# Altium schematic sheet LEDS & BUTTONS.SchDoc
size 381 x 241 mm
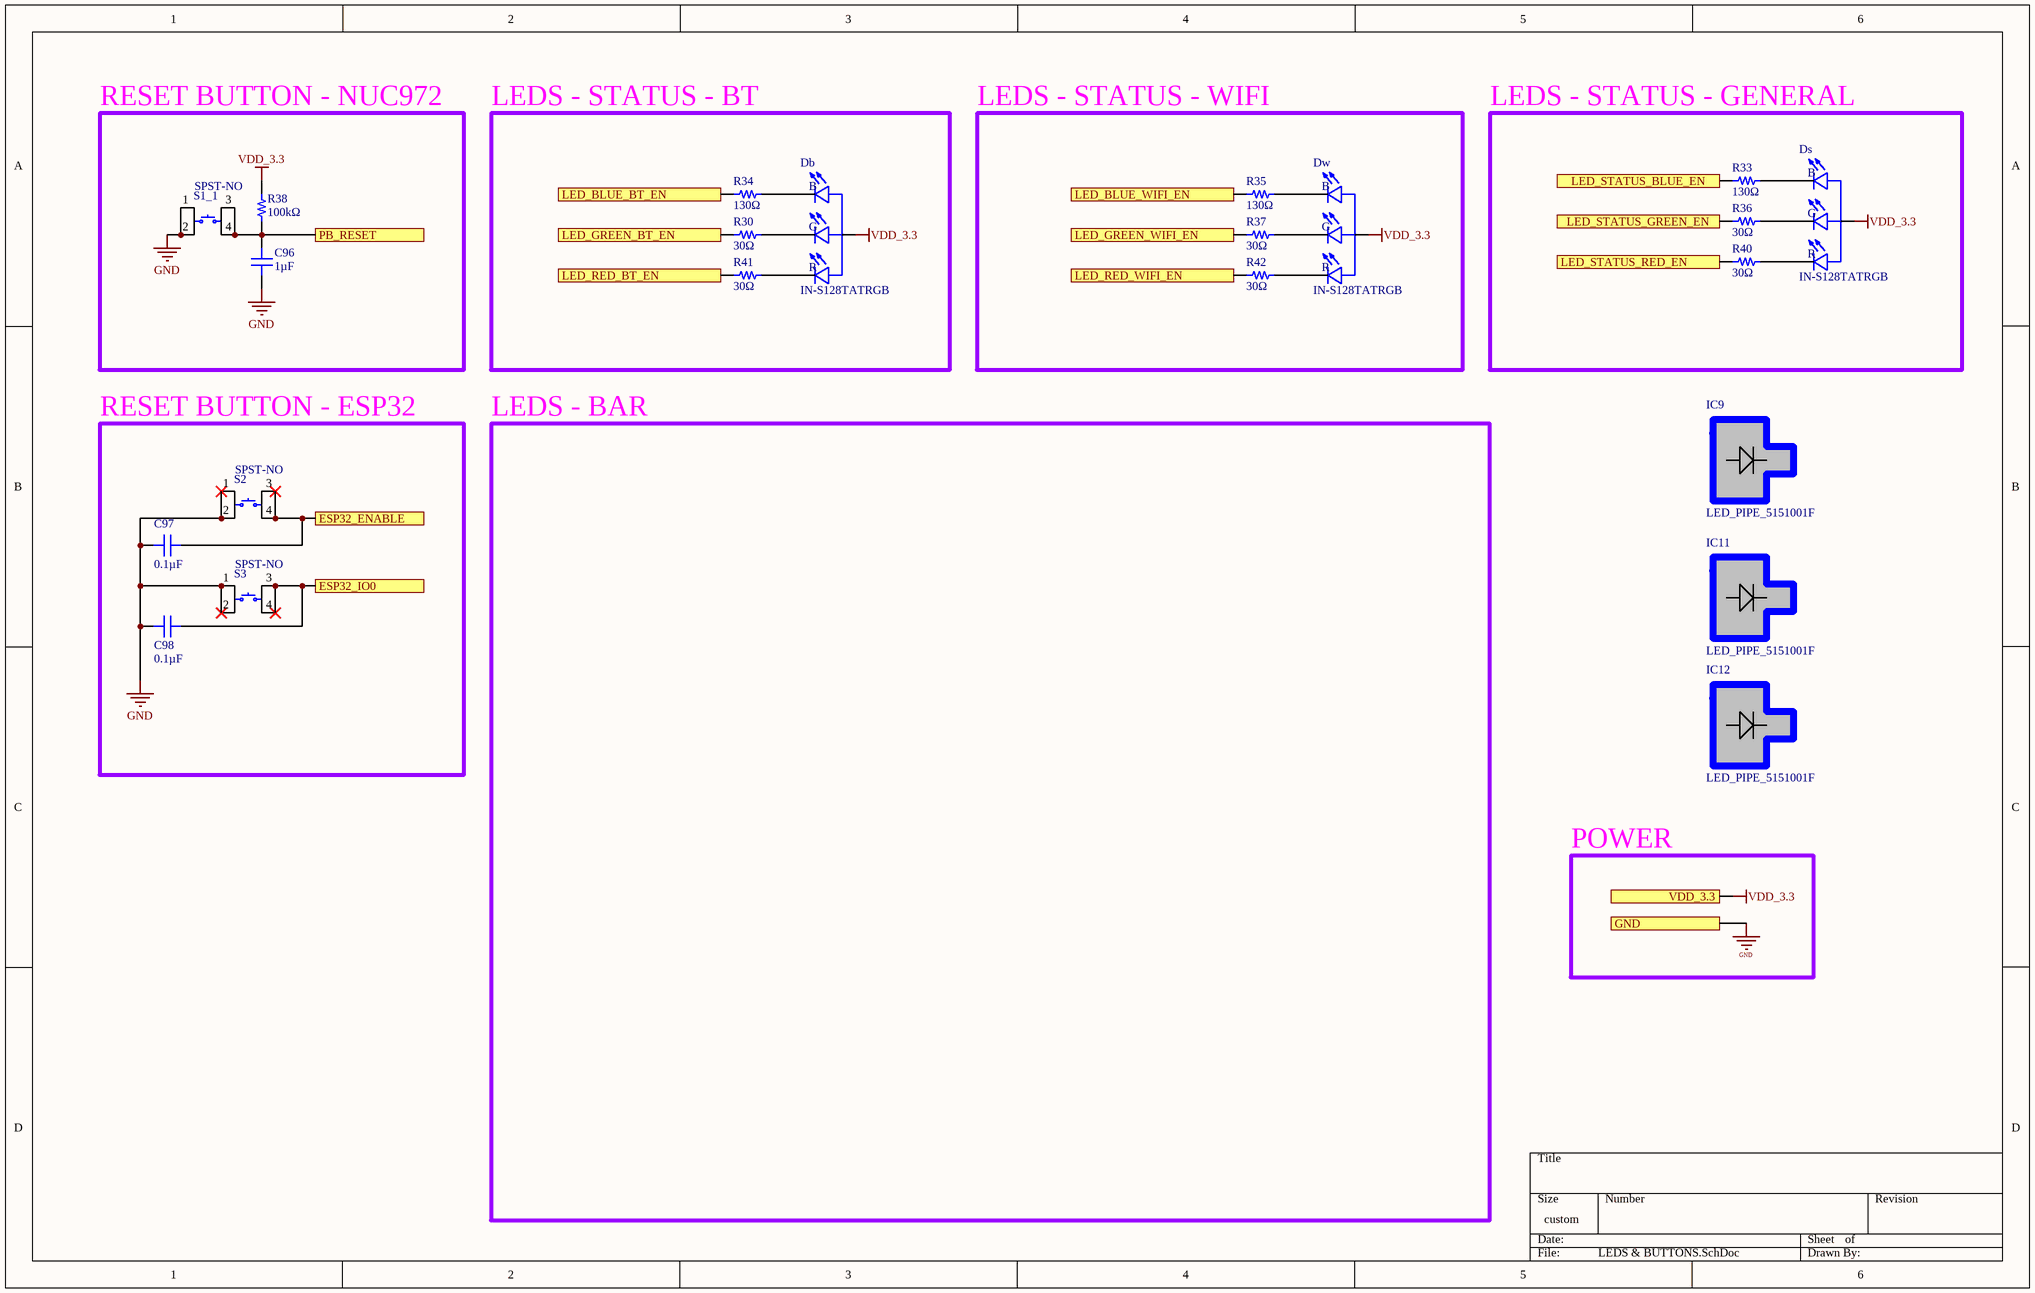
[diagram p0: LEDS & BUTTONS.SchDoc]

## Parts
C96  1µF  [CAP 0603_1608]
C97  0.1µF  [CAP 0603_1608 RF]
C98  0.1µF  [CAP 0603_1608 RF]
Db  IN-S128TATRGB  [LEDSC270X320X110-4N]
Ds  IN-S128TATRGB  [LEDSC270X320X110-4N]
Dw  IN-S128TATRGB  [LEDSC270X320X110-4N]
IC9  LED_PIPE_5151001F  [LED PIPE 5151001F]
IC11  LED_PIPE_5151001F  [LED PIPE 5151001F]
IC12  LED_PIPE_5151001F  [LED PIPE 5151001F]
R30  30Ω  [RES 0603_1608 RF]
R33  130Ω  [RES 0603_1608 RF]
R34  130Ω  [RES 0603_1608 RF]
R35  130Ω  [RES 0603_1608 RF]
R36  30Ω  [RES 0603_1608 RF]
R37  30Ω  [RES 0603_1608 RF]
R38  100kΩ  [RES 0402_1005 RF]
R40  30Ω  [RES 0603_1608 RF]
R41  30Ω  [RES 0603_1608 RF]
R42  30Ω  [RES 0603_1608 RF]
S1_1  SPST-NO  [TE FSM4JSMA]
S2  SPST-NO  [TE FSM4JSMA]
S3  SPST-NO  [TE FSM4JSMA]

## Blocks framed on the sheet
RESET BUTTON - NUC972: C96 R38 S1_1
LEDS - STATUS - BT: Db R30 R34 R41
LEDS - STATUS - WIFI: Dw R35 R37 R42
LEDS - STATUS - GENERAL: Ds R33 R36 R40
RESET BUTTON - ESP32: C97 C98 S2 S3

## Ports
ESP32_ENABLE, ESP32_IO0, GND, LED_BLUE_BT_EN, LED_BLUE_WIFI_EN, LED_GREEN_BT_EN, LED_GREEN_WIFI_EN, LED_RED_BT_EN, LED_RED_WIFI_EN, LED_STATUS_BLUE_EN, LED_STATUS_GREEN_EN, LED_STATUS_RED_EN, PB_RESET, VDD_3.3

## Nets
GND: C96.1 C97.2 C98.2 S1_1.1 S1_1.2 S2.1 S2.2 S3.1 S3.2 ; port GND
VDD_3.3: Db.1 Ds.1 Dw.1 R38.2 ; port VDD_3.3
ESP32_ENABLE: C97.1 S2.3 S2.4 ; port ESP32_ENABLE
ESP32_IO0: C98.1 S3.3 S3.4 ; port ESP32_IO0
LED_BLUE_BT_EN: R34.1 ; port LED_BLUE_BT_EN
LED_BLUE_WIFI_EN: R35.1 ; port LED_BLUE_WIFI_EN
LED_GREEN_BT_EN: R30.1 ; port LED_GREEN_BT_EN
LED_GREEN_WIFI_EN: R37.1 ; port LED_GREEN_WIFI_EN
LED_RED_BT_EN: R41.1 ; port LED_RED_BT_EN
LED_RED_WIFI_EN: R42.1 ; port LED_RED_WIFI_EN
LED_STATUS_BLUE_EN: R33.1 ; port LED_STATUS_BLUE_EN
LED_STATUS_GREEN_EN: R36.1 ; port LED_STATUS_GREEN_EN
LED_STATUS_RED_EN: R40.1 ; port LED_STATUS_RED_EN
PB_RESET: C96.2 R38.1 S1_1.3 S1_1.4 ; port PB_RESET
NetDb_2: Db.2 R34.2
NetDb_3: Db.3 R41.2
NetDb_4: Db.4 R30.2
NetDs_2: Ds.2 R33.2
NetDs_3: Ds.3 R40.2
NetDs_4: Ds.4 R36.2
NetDw_2: Dw.2 R35.2
NetDw_3: Dw.3 R42.2
NetDw_4: Dw.4 R37.2

## Notes on the sheet
- LEDS - BAR
- POWER
- (in symbol IN-S128TATRGB) B; G; R

## Library data of the parts
C96 = CAP00007: CAP CER 1UF 10V X7R 0603; Manufacturer: KEMET; Manufacturer P/N: C0603C105K8RACTU; Tolerance: ±10%; Device ID: CAP00007; Mounting Type: Surface Mount; Part Type: Capacitor; VALUE: 1µF; Operating Temperature: -55°C ~ 125°C; Voltage: 10V; Package: 0603 (1608 Metric); Supplier1: Digi-Key; Supplier1 P/N: 399-11133-1-ND; Supplier2: Mouser; Supplier2 P/N: 80-C0603C105K8R; Temperature Coefficient: X7R
C97 C98 = CAP00039: CAP CER 0.1UF 16V X7R 0603; Manufacturer: KEMET; Manufacturer P/N: C0603C104M4RACAUTO; Tolerance: ±20%; Device ID: CAP00039; Mounting Type: Surface Mount; Part Type: Capacitor; VALUE: 0.1µF; Operating Temperature: -55°C ~ 125°C; Voltage: 16V; Package: 0603 (1608 Metric); Supplier1: Digi-Key; Supplier1 P/N: 399-C0603C104M4RACAUTOCT-ND; Supplier2: Mouser; Supplier2 P/N: C0603C104M4RACAUTO; Temperature Coefficient: X7R
Db Ds Dw = IN-S128TATRGB: Red, Green, Blue _RGB_ 625nm Red, 520nm Green, 465nm Blue LED Indication - Discrete 2.2V Red, 3.2V Green, 3.2V Blue 1210 _3225 Metric_; MF: Inolux; MP: IN-S128TATRGB; SnapEDA_Link: https://www.snapeda.com/parts/IN-S128TATRGB/Inolux/view-part/3219922/?ref=snap; Price: None; Package: 1210 Inolux; Availability: Unavailable; Value: *
IC9 IC11 IC12 = LED0000E: -; VALUE: PIPE; Device ID: LED0000E; Mounting Type: Surface Mount; Part Type: LED; Manufacturer: -; Manufacturer P/N: -; Operating Temperature: -; Package: -; Color: -; If - Forward Current: -; Vf - Forward Voltage: -; Wavelength: -; Viewing Angle: -; Lens Color: -; Supplier1: -; Supplier1 P/N: -
R30 R36 R37 R40-R42 = RES00039: RES 30 OHM 1% 1/10W 0603; Manufacturer: Vishay Dale; Manufacturer P/N: ‎CRCW0603820KFKEAC‎; Power: 0.100W; Device ID: RES00039; VALUE: 30Ω; Mounting Type: Surface Mount; Part Type: Resistor; Operating Temperature: -55°C ~ 155°C; Package: 0603 (1608 Metric); Tolerance: ±1%; Composition: Thick Film; Supplier1: Digi-Key; Supplier1 P/N: ‎541-5568-1-ND‎; Supplier2: Mouser; Supplier2 P/N: 71-CRCW0603820KFKEAC
R33-R35 = RES00038: RES 130 OHM 1% 1/10W 0603; Manufacturer: Vishay Dale; Manufacturer P/N: ‎CRCW0603820KFKEAC‎; Power: 0.100W; Device ID: RES00038; VALUE: 130Ω; Mounting Type: Surface Mount; Part Type: Resistor; Operating Temperature: -55°C ~ 155°C; Package: 0603 (1608 Metric); Tolerance: ±1%; Composition: Thick Film; Supplier1: Digi-Key; Supplier1 P/N: ‎541-5568-1-ND‎; Supplier2: Mouser; Supplier2 P/N: 71-CRCW0603820KFKEAC
R38 = RES0001D: RES SMD 100K OHM 1% 1/16W 0402; Manufacturer: Vishay Dale; Manufacturer P/N: RCG0402100KFKED; Power: 0.063W; Device ID: RES0001D; VALUE: 100kΩ; Mounting Type: Surface Mount; Part Type: Resistor; Operating Temperature: -55°C ~ 155°C; Package: 0402 (1005 Metric); Tolerance: ±1%; Composition: Thick Film; Supplier1: Digi-Key; Supplier1 P/N: 541-1751-1-ND; Supplier2: Mouser; Supplier2 P/N: 71-RCG0402100KFKED
S1_1 S2 S3 = GPTS202312B: SWITCH TACTILE SPST-NO 0.05A 24V; Manufacturer: TE Connectivity ALCOSWITCH Switches; Manufacturer P/N: FSM4JSMASTR; Switch Function: Off-Mom; Contact Rating @ Voltage: 0.05A @ 24VDC; Operating Force: 160gf; Device ID: GPTS202312B; Part Type: Button; VALUE: SPST-NO; Operating Temperature: -40°C ~ 105°C; Package: 4-Lead SMT; Supplier1: Digi-Key; Supplier1 P/N: 450-2141-1-ND; Supplier2: Mouser; Supplier2 P/N: 506-1-1977223-0; Mounting Type: Surface Mount